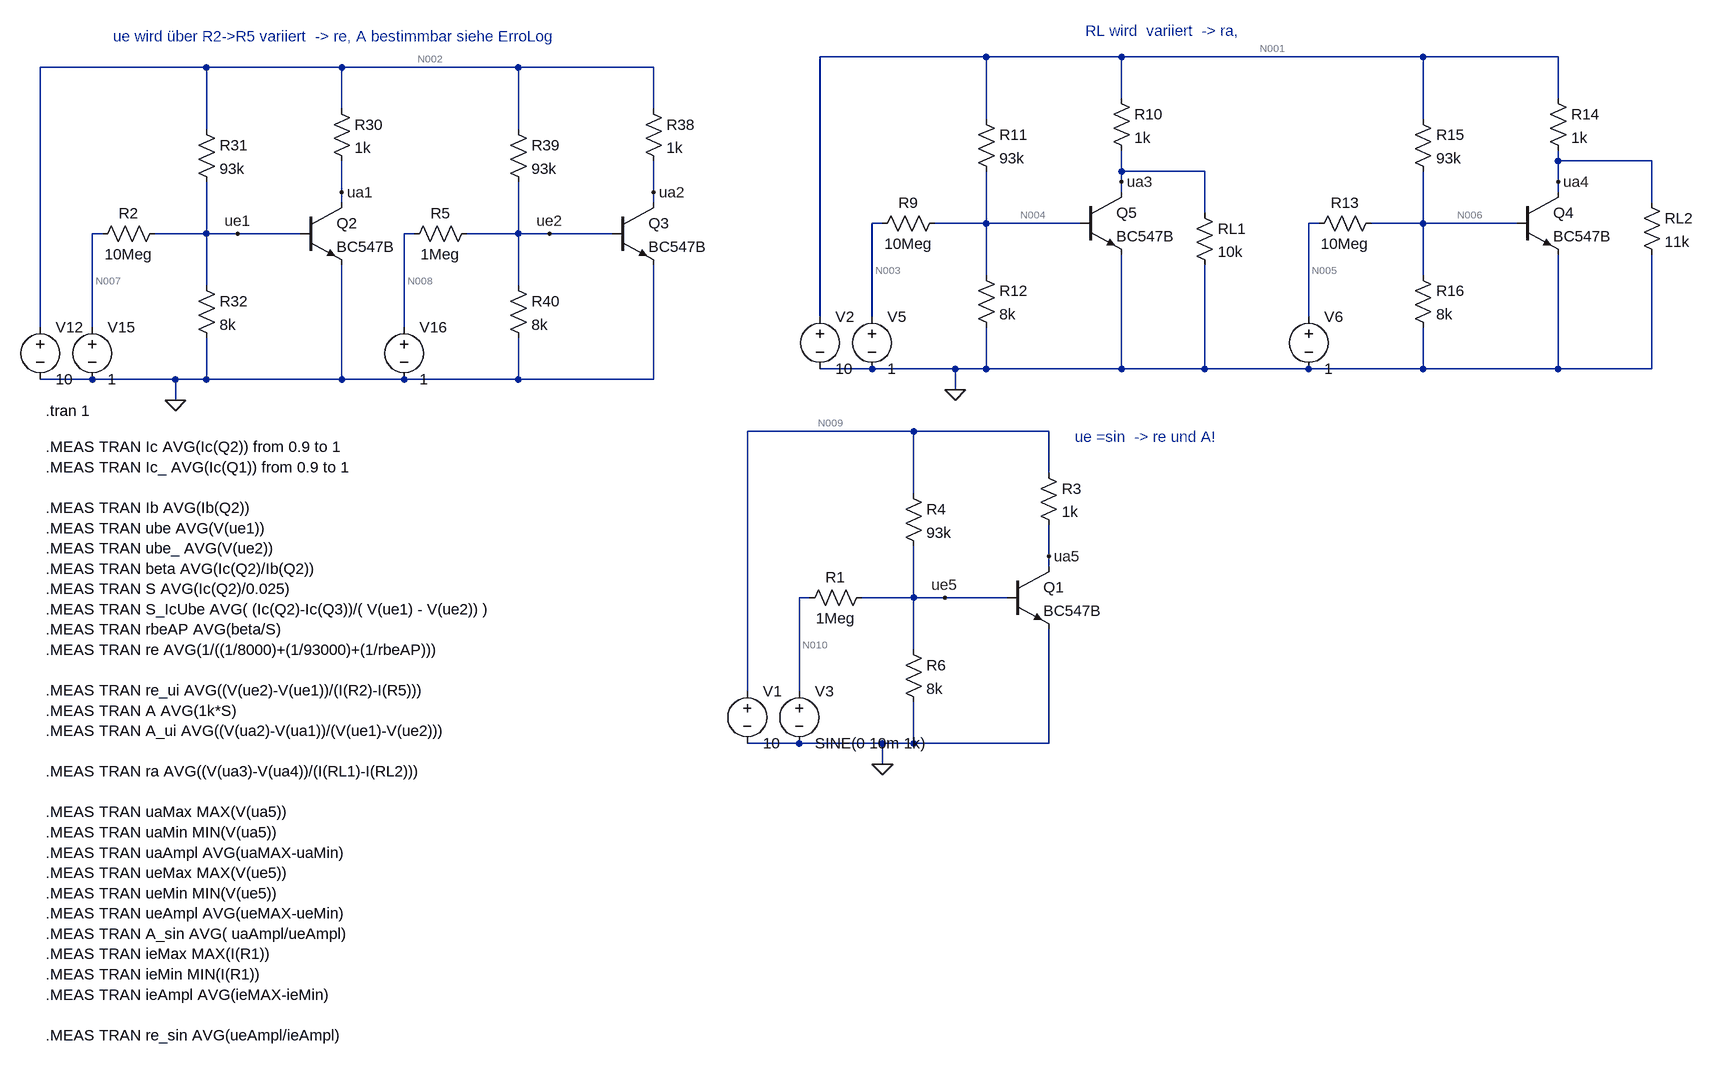
[diagram p0: schematic Tr_EmSchOhneRe_.asc]
Tr_EmSchOhneRe_.asc, the LTspice schematic file:
Version 4
SHEET 1 880 680
WIRE -3328 -1520 -3584 -1520
WIRE -3120 -1520 -3328 -1520
WIRE -2656 -1520 -3120 -1520
WIRE -2448 -1520 -2656 -1520
WIRE -4528 -1504 -4784 -1504
WIRE -4320 -1504 -4528 -1504
WIRE -4048 -1504 -4320 -1504
WIRE -3840 -1504 -4048 -1504
WIRE -3120 -1456 -3120 -1520
WIRE -2448 -1456 -2448 -1520
WIRE -4320 -1440 -4320 -1504
WIRE -3840 -1440 -3840 -1504
WIRE -3328 -1424 -3328 -1520
WIRE -2656 -1424 -2656 -1520
WIRE -4528 -1408 -4528 -1504
WIRE -4048 -1408 -4048 -1504
WIRE -2448 -1360 -2448 -1376
WIRE -2304 -1360 -2448 -1360
WIRE -3120 -1344 -3120 -1376
WIRE -2992 -1344 -3120 -1344
WIRE -3120 -1328 -3120 -1344
WIRE -2448 -1328 -2448 -1360
WIRE -4320 -1312 -4320 -1360
WIRE -3840 -1312 -3840 -1360
WIRE -3120 -1312 -3120 -1328
WIRE -2448 -1312 -2448 -1328
WIRE -4320 -1296 -4320 -1312
WIRE -3840 -1296 -3840 -1312
WIRE -2304 -1296 -2304 -1360
WIRE -2992 -1280 -2992 -1344
WIRE -3488 -1264 -3504 -1264
WIRE -3328 -1264 -3328 -1344
WIRE -3328 -1264 -3408 -1264
WIRE -3184 -1264 -3328 -1264
WIRE -2816 -1264 -2832 -1264
WIRE -2656 -1264 -2656 -1344
WIRE -2656 -1264 -2736 -1264
WIRE -2512 -1264 -2656 -1264
WIRE -4688 -1248 -4704 -1248
WIRE -4528 -1248 -4528 -1328
WIRE -4528 -1248 -4608 -1248
WIRE -4480 -1248 -4528 -1248
WIRE -4384 -1248 -4480 -1248
WIRE -4208 -1248 -4224 -1248
WIRE -4048 -1248 -4048 -1328
WIRE -4048 -1248 -4128 -1248
WIRE -4000 -1248 -4048 -1248
WIRE -3904 -1248 -4000 -1248
WIRE -3328 -1184 -3328 -1264
WIRE -2656 -1184 -2656 -1264
WIRE -4528 -1168 -4528 -1248
WIRE -4048 -1168 -4048 -1248
WIRE -3584 -1120 -3584 -1520
WIRE -3504 -1120 -3504 -1264
WIRE -2832 -1120 -2832 -1264
WIRE -4784 -1104 -4784 -1504
WIRE -4704 -1104 -4704 -1248
WIRE -4224 -1104 -4224 -1248
WIRE -3504 -1040 -3584 -1040
WIRE -3376 -1040 -3504 -1040
WIRE -3328 -1040 -3328 -1104
WIRE -3328 -1040 -3376 -1040
WIRE -3120 -1040 -3120 -1216
WIRE -3120 -1040 -3328 -1040
WIRE -2992 -1040 -2992 -1200
WIRE -2992 -1040 -3120 -1040
WIRE -2832 -1040 -2992 -1040
WIRE -2656 -1040 -2656 -1104
WIRE -2656 -1040 -2832 -1040
WIRE -2448 -1040 -2448 -1216
WIRE -2448 -1040 -2656 -1040
WIRE -2304 -1040 -2304 -1216
WIRE -2304 -1040 -2448 -1040
WIRE -4704 -1024 -4784 -1024
WIRE -4576 -1024 -4704 -1024
WIRE -4528 -1024 -4528 -1088
WIRE -4528 -1024 -4576 -1024
WIRE -4320 -1024 -4320 -1200
WIRE -4320 -1024 -4528 -1024
WIRE -4224 -1024 -4320 -1024
WIRE -4048 -1024 -4048 -1088
WIRE -4048 -1024 -4224 -1024
WIRE -3840 -1024 -3840 -1200
WIRE -3840 -1024 -4048 -1024
WIRE -3376 -1008 -3376 -1040
WIRE -4576 -992 -4576 -1024
WIRE -3440 -944 -3696 -944
WIRE -3232 -944 -3440 -944
WIRE -3232 -880 -3232 -944
WIRE -3440 -848 -3440 -944
WIRE -3232 -752 -3232 -800
WIRE -3232 -736 -3232 -752
WIRE -3600 -688 -3616 -688
WIRE -3440 -688 -3440 -768
WIRE -3440 -688 -3520 -688
WIRE -3392 -688 -3440 -688
WIRE -3296 -688 -3392 -688
WIRE -3440 -608 -3440 -688
WIRE -3696 -544 -3696 -944
WIRE -3616 -544 -3616 -688
WIRE -3616 -464 -3696 -464
WIRE -3488 -464 -3616 -464
WIRE -3440 -464 -3440 -528
WIRE -3440 -464 -3488 -464
WIRE -3232 -464 -3232 -640
WIRE -3232 -464 -3440 -464
WIRE -3488 -432 -3488 -464
FLAG -3376 -1008 0
FLAG -3120 -1328 ua3
FLAG -2448 -1328 ua4
FLAG -4576 -992 0
FLAG -4480 -1248 ue1
FLAG -4000 -1248 ue2
FLAG -4320 -1312 ua1
FLAG -3840 -1312 ua2
FLAG -3488 -432 0
FLAG -3392 -688 ue5
FLAG -3232 -752 ua5
SYMBOL voltage -3584 -1136 R0
WINDOW 123 0 0 Left 2
WINDOW 39 0 0 Left 2
SYMATTR InstName V2
SYMATTR Value 10
SYMBOL npn -3184 -1312 R0
SYMATTR InstName Q5
SYMATTR Value BC547B
SYMBOL res -3392 -1280 R90
WINDOW 0 0 56 VBottom 2
WINDOW 3 32 56 VTop 2
SYMATTR InstName R9
SYMATTR Value 10Meg
SYMBOL voltage -3504 -1136 R0
WINDOW 123 0 0 Left 2
WINDOW 39 0 0 Left 2
SYMATTR InstName V5
SYMATTR Value 1
SYMBOL res -3136 -1472 R0
SYMATTR InstName R10
SYMATTR Value 1k
SYMBOL res -3344 -1440 R0
SYMATTR InstName R11
SYMATTR Value 93k
SYMBOL res -3344 -1200 R0
SYMATTR InstName R12
SYMATTR Value 8k
SYMBOL npn -2512 -1312 R0
SYMATTR InstName Q4
SYMATTR Value BC547B
SYMBOL res -2720 -1280 R90
WINDOW 0 0 56 VBottom 2
WINDOW 3 32 56 VTop 2
SYMATTR InstName R13
SYMATTR Value 10Meg
SYMBOL voltage -2832 -1136 R0
WINDOW 123 0 0 Left 2
WINDOW 39 0 0 Left 2
SYMATTR InstName V6
SYMATTR Value 1
SYMBOL res -2464 -1472 R0
SYMATTR InstName R14
SYMATTR Value 1k
SYMBOL res -2672 -1440 R0
SYMATTR InstName R15
SYMATTR Value 93k
SYMBOL res -2672 -1200 R0
SYMATTR InstName R16
SYMATTR Value 8k
SYMBOL res -3008 -1296 R0
SYMATTR InstName RL1
SYMATTR Value 10k
SYMBOL res -2320 -1312 R0
SYMATTR InstName RL2
SYMATTR Value 11k
SYMBOL voltage -4784 -1120 R0
WINDOW 123 0 0 Left 2
WINDOW 39 0 0 Left 2
SYMATTR InstName V12
SYMATTR Value 10
SYMBOL npn -4384 -1296 R0
SYMATTR InstName Q2
SYMATTR Value BC547B
SYMBOL res -4592 -1264 R90
WINDOW 0 0 56 VBottom 2
WINDOW 3 32 56 VTop 2
SYMATTR InstName R2
SYMATTR Value 10Meg
SYMBOL voltage -4704 -1120 R0
WINDOW 123 0 0 Left 2
WINDOW 39 0 0 Left 2
SYMATTR InstName V15
SYMATTR Value 1
SYMBOL res -4336 -1456 R0
SYMATTR InstName R30
SYMATTR Value 1k
SYMBOL res -4544 -1424 R0
SYMATTR InstName R31
SYMATTR Value 93k
SYMBOL res -4544 -1184 R0
SYMATTR InstName R32
SYMATTR Value 8k
SYMBOL npn -3904 -1296 R0
SYMATTR InstName Q3
SYMATTR Value BC547B
SYMBOL res -4112 -1264 R90
WINDOW 0 0 56 VBottom 2
WINDOW 3 32 56 VTop 2
SYMATTR InstName R5
SYMATTR Value 1Meg
SYMBOL voltage -4224 -1120 R0
WINDOW 123 0 0 Left 2
WINDOW 39 0 0 Left 2
SYMATTR InstName V16
SYMATTR Value 1
SYMBOL res -3856 -1456 R0
SYMATTR InstName R38
SYMATTR Value 1k
SYMBOL res -4064 -1424 R0
SYMATTR InstName R39
SYMATTR Value 93k
SYMBOL res -4064 -1184 R0
SYMATTR InstName R40
SYMATTR Value 8k
SYMBOL voltage -3696 -560 R0
WINDOW 123 0 0 Left 2
WINDOW 39 0 0 Left 2
SYMATTR InstName V1
SYMATTR Value 10
SYMBOL npn -3296 -736 R0
SYMATTR InstName Q1
SYMATTR Value BC547B
SYMBOL res -3504 -704 R90
WINDOW 0 0 56 VBottom 2
WINDOW 3 32 56 VTop 2
SYMATTR InstName R1
SYMATTR Value 1Meg
SYMBOL voltage -3616 -560 R0
WINDOW 123 0 0 Left 2
WINDOW 39 0 0 Left 2
SYMATTR InstName V3
SYMATTR Value SINE(0 10m 1k)
SYMBOL res -3248 -896 R0
SYMATTR InstName R3
SYMATTR Value 1k
SYMBOL res -3456 -864 R0
SYMATTR InstName R4
SYMATTR Value 93k
SYMBOL res -3456 -624 R0
SYMATTR InstName R6
SYMATTR Value 8k
TEXT -4776 -920 Left 2 !.MEAS TRAN Ic AVG(Ic(Q2)) from 0.9 to 1\n.MEAS TRAN Ic_ AVG(Ic(Q1)) from 0.9 to 1\n \n.MEAS TRAN Ib AVG(Ib(Q2))\n.MEAS TRAN ube AVG(V(ue1))\n.MEAS TRAN ube_ AVG(V(ue2))\n.MEAS TRAN beta AVG(Ic(Q2)/Ib(Q2))\n.MEAS TRAN S AVG(Ic(Q2)/0.025)\n.MEAS TRAN S_IcUbe AVG( (Ic(Q2)-Ic(Q3))/( V(ue1) - V(ue2)) )\n.MEAS TRAN rbeAP AVG(beta/S)\n.MEAS TRAN re AVG(1/((1/8000)+(1/93000)+(1/rbeAP)))\n \n.MEAS TRAN re_ui AVG((V(ue2)-V(ue1))/(I(R2)-I(R5)))\n.MEAS TRAN A AVG(1k*S)\n.MEAS TRAN A_ui AVG((V(ua2)-V(ua1))/(V(ue1)-V(ue2)))\n \n.MEAS TRAN ra AVG((V(ua3)-V(ua4))/(I(RL1)-I(RL2)))\n \n.MEAS TRAN uaMax MAX(V(ua5))\n.MEAS TRAN uaMin MIN(V(ua5))\n.MEAS TRAN uaAmpl AVG(uaMAX-uaMin)\n.MEAS TRAN ueMax MAX(V(ue5))\n.MEAS TRAN ueMin MIN(V(ue5))\n.MEAS TRAN ueAmpl AVG(ueMAX-ueMin)\n.MEAS TRAN A_sin AVG( uaAmpl/ueAmpl) \n.MEAS TRAN ieMax MAX(I(R1))\n.MEAS TRAN ieMin MIN(I(R1))\n.MEAS TRAN ieAmpl AVG(ieMAX-ieMin)\n \n.MEAS TRAN re_sin AVG(ueAmpl/ieAmpl)
TEXT -4776 -976 Left 2 !.tran 1
TEXT -4672 -1552 Left 2 ;ue wird über R2->R5 variiert  -> re, A bestimmbar siehe ErroLog
TEXT -3176 -1560 Left 2 ;RL wird  variiert  -> ra,
TEXT -3192 -936 Left 2 ;ue =sin  -> re und A!

The netlist it stands for:
* Tr_EmSchOhneRe_.asc
V2 N001 0 10
Q5 ua3 N004 0 0 BC547B
R9 N004 N003 10Meg
V5 N003 0 1
R10 N001 ua3 1k
R11 N001 N004 93k
R12 N004 0 8k
Q4 ua4 N006 0 0 BC547B
R13 N006 N005 10Meg
V6 N005 0 1
R14 N001 ua4 1k
R15 N001 N006 93k
R16 N006 0 8k
RL1 ua3 0 10k
RL2 ua4 0 11k
V12 N002 0 10
Q2 ua1 ue1 0 0 BC547B
R2 ue1 N007 10Meg
V15 N007 0 1
R30 N002 ua1 1k
R31 N002 ue1 93k
R32 ue1 0 8k
Q3 ua2 ue2 0 0 BC547B
R5 ue2 N008 1Meg
V16 N008 0 1
R38 N002 ua2 1k
R39 N002 ue2 93k
R40 ue2 0 8k
V1 N009 0 10
Q1 ua5 ue5 0 0 BC547B
R1 ue5 N010 1Meg
V3 N010 0 SINE(0 10m 1k)
R3 N009 ua5 1k
R4 N009 ue5 93k
R6 ue5 0 8k
.model NPN NPN
.model PNP PNP
.lib standard.bjt
.MEAS TRAN Ic AVG(Ic(Q2)) from 0.9 to 1
.MEAS TRAN Ic_ AVG(Ic(Q1)) from 0.9 to 1
.MEAS TRAN Ib AVG(Ib(Q2))
.MEAS TRAN ube AVG(V(ue1))
.MEAS TRAN ube_ AVG(V(ue2))
.MEAS TRAN beta AVG(Ic(Q2)/Ib(Q2))
.MEAS TRAN S AVG(Ic(Q2)/0.025)
.MEAS TRAN S_IcUbe AVG( (Ic(Q2)-Ic(Q3))/( V(ue1) - V(ue2)) )
.MEAS TRAN rbeAP AVG(beta/S)
.MEAS TRAN re AVG(1/((1/8000)+(1/93000)+(1/rbeAP)))
.MEAS TRAN re_ui AVG((V(ue2)-V(ue1))/(I(R2)-I(R5)))
.MEAS TRAN A AVG(1k*S)
.MEAS TRAN A_ui AVG((V(ua2)-V(ua1))/(V(ue1)-V(ue2)))
.MEAS TRAN ra AVG((V(ua3)-V(ua4))/(I(RL1)-I(RL2)))
.MEAS TRAN uaMax MAX(V(ua5))
.MEAS TRAN uaMin MIN(V(ua5))
.MEAS TRAN uaAmpl AVG(uaMAX-uaMin)
.MEAS TRAN ueMax MAX(V(ue5))
.MEAS TRAN ueMin MIN(V(ue5))
.MEAS TRAN ueAmpl AVG(ueMAX-ueMin)
.MEAS TRAN A_sin AVG( uaAmpl/ueAmpl)
.MEAS TRAN ieMax MAX(I(R1))
.MEAS TRAN ieMin MIN(I(R1))
.MEAS TRAN ieAmpl AVG(ieMAX-ieMin)
.MEAS TRAN re_sin AVG(ueAmpl/ieAmpl)
.tran 1
* ue wird über R2->R5 variiert  -> re, A bestimmbar siehe ErroLog
* RL wird  variiert  -> ra,
* ue =sin  -> re und A!
.backanno
.end

* Results of the author's LTspice run, read from the files saved beside the schematic
* Operating Point, zero values left out:
*   V(n001) = 10 V
*   V(ua3) = 4.961 V
*   V(n004) = 679 mV
*   V(n003) = 1 V
*   V(ua4) = 5 V
*   V(n006) = 679 mV
*   V(n005) = 1 V
*   V(n002) = 10 V
*   V(ua1) = 5.426 V
*   V(ue1) = 679 mV
*   V(n007) = 1 V
*   V(ua2) = 5.363 V
*   V(ue2) = 679.4 mV
*   V(n008) = 1 V
*   V(n009) = 10 V
*   V(ua5) = 5.579 V
*   V(ue5) = 678 mV
*   Ic(Q1) = 4.421 mA
*   Ib(Q1) = 14.81 µA
*   Ie(Q1) = -4.436 mA
*   Ic(Q3) = 4.637 mA
*   Ib(Q3) = 15.61 µA
*   Ie(Q3) = -4.652 mA
*   Ic(Q2) = 4.574 mA
*   Ib(Q2) = 15.38 µA
*   Ie(Q2) = -4.59 mA
*   Ic(Q4) = 4.545 mA
*   Ib(Q4) = 15.38 µA
*   Ie(Q4) = -4.561 mA
*   Ic(Q5) = 4.543 mA
*   Ib(Q5) = 15.38 µA
*   Ie(Q5) = -4.558 mA
*   I(R6) = 84.75 µA
*   I(R4) = 100.2 µA
*   I(R3) = 4.421 mA
*   I(R1) = 678 nA
*   I(R40) = 84.93 µA
*   I(R39) = 100.2 µA
*   I(R38) = 4.637 mA
*   I(R5) = -320.6 nA
*   I(R32) = 84.88 µA
*   I(R31) = 100.2 µA
*   I(R30) = 4.574 mA
*   I(R2) = -32.1 nA
*   I(Rl2) = 454.5 µA
*   I(Rl1) = 496.1 µA
*   I(R16) = 84.88 µA
*   I(R15) = 100.2 µA
*   I(R14) = 5 mA
*   I(R13) = -32.1 nA
*   I(R12) = 84.88 µA
*   I(R11) = 100.2 µA
*   I(R10) = 5.039 mA
*   I(R9) = -32.1 nA
*   I(V3) = 678 nA
*   I(V1) = -4.521 mA
*   I(V16) = -320.6 nA
*   I(V15) = -32.1 nA
*   I(V12) = -9.412 mA
*   I(V6) = -32.1 nA
*   I(V5) = -32.1 nA
*   I(V2) = -10.24 mA
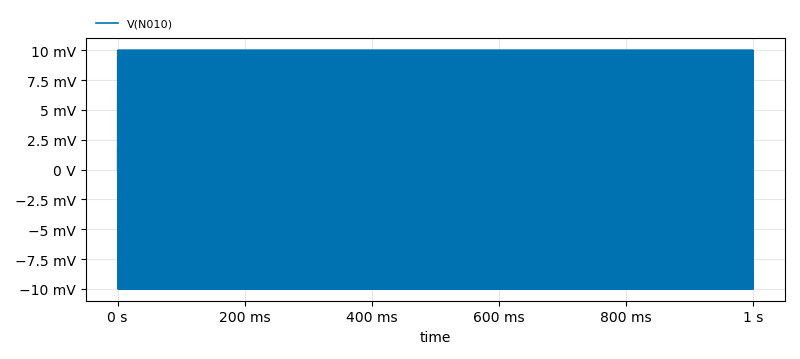
[diagram p1: Transient Analysis of Tr_EmSchOhneRe_.asc, plotted from the saved traces]
* Transient Analysis, 1 run:
*   V(N010): min -9.995 mV, max 9.995 mV, average 2.918 nV, rms 7.188 mV, last 0 V
* From the log:
*   ic: AVG(ic(q2))=0.0045744 FROM 0.9 TO 1
*   ic_: AVG(ic(q1))=0.00442081 FROM 0.9 TO 1
*   ib: AVG(ib(q2))=1.53789e-005 FROM 0 TO 1
*   ube: AVG(v(ue1))=0.67903 FROM 0 TO 1
*   ube_: AVG(v(ue2))=0.679449 FROM 0 TO 1
*   beta: AVG(ic(q2)/ib(q2))=297.447 FROM 0 TO 1
*   s: AVG(ic(q2)/0.025)=0.182976 FROM 0 TO 1
*   s_icube: AVG( (ic(q2)-ic(q3))/( v(ue1) - v(ue2)) )=0.148642 FROM 0 TO 1
*   rbeap: AVG(beta/s)=1625.61 FROM 0 TO 1
*   re: AVG(1/((1/8000)+(1/93000)+(1/rbeap)))=1331.72 FROM 0 TO 1
*   re_ui: AVG((v(ue2)-v(ue1))/(i(r2)-i(r5)))=1455.33 FROM 0 TO 1
*   a: AVG(1k*s)=182.976 FROM 0 TO 1
*   a_ui: AVG((v(ua2)-v(ua1))/(v(ue1)-v(ue2)))=148.641 FROM 0 TO 1
*   ra: AVG((v(ua3)-v(ua4))/(i(rl1)-i(rl2)))=-936.331 FROM 0 TO 1
*   uamax: MAX(v(ua5))=5.58134 FROM 0 TO 1
*   uamin: MIN(v(ua5))=5.57704 FROM 0 TO 1
*   uaampl: AVG(uamax-uamin)=0.00430441 FROM 0 TO 1
*   uemax: MAX(v(ue5))=0.677991 FROM 0 TO 1
*   uemin: MIN(v(ue5))=0.677961 FROM 0 TO 1
*   ueampl: AVG(uemax-uemin)=2.99215e-005 FROM 0 TO 1
*   a_sin: AVG( uaampl/ueampl)=143.857 FROM 0 TO 1
*   iemax: MAX(i(r1))=6.87929e-007 FROM 0 TO 1
*   iemin: MIN(i(r1))=6.68022e-007 FROM 0 TO 1
*   ieampl: AVG(iemax-iemin)=1.99063e-008 FROM 0 TO 1
*   re_sin: AVG(ueampl/ieampl)=1503.12 FROM 0 TO 1